# Altium project 000_stm32.PrjPcb
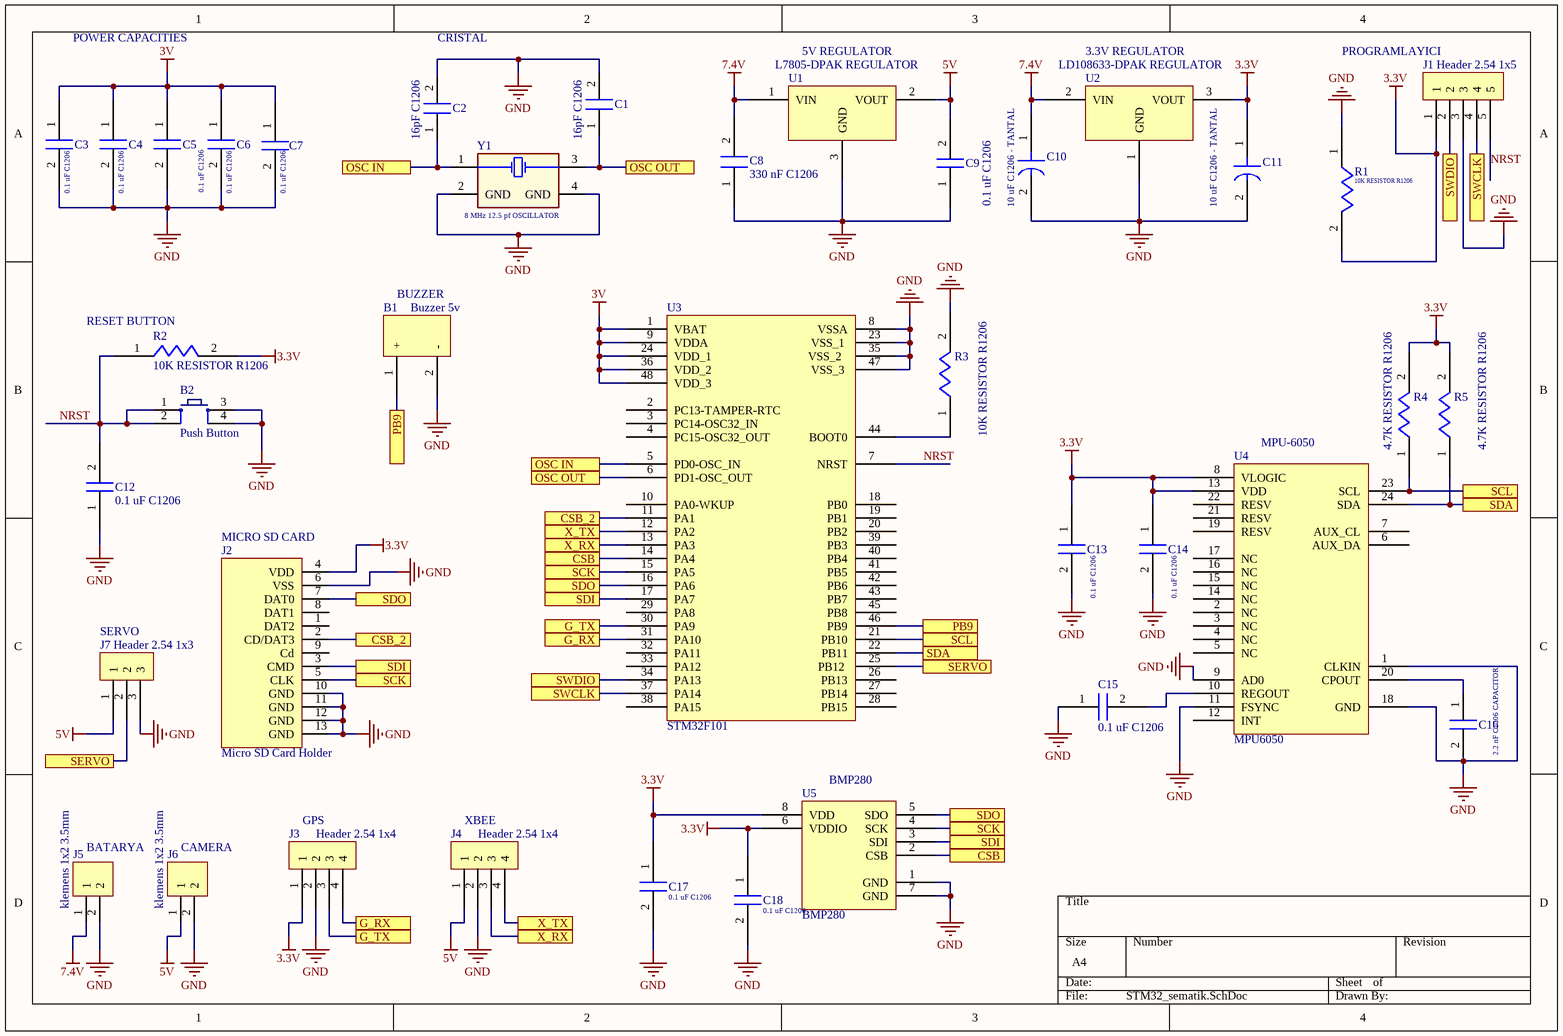
[diagram p0: STM32_sematik.SchDoc]
1 sheet, 38 parts. Net scope: flat (ports and power ports of the same name join across sheets).
Board file: STM32_PCB.PcbDoc

## Sheet STM32_sematik.SchDoc
size A4; SheetNumber: 1; SheetTotal: 1

### Parts
B1  Buzzer 5v  [Buzzer 5V]
B2  Push Button  [PUSB BUTTON-SMD]
C1  16pF C1206  [C1206]
C2  16pF C1206  [C1206]
C3  0.1 uF C1206  [C1206]
C4  0.1 uF C1206  [C1206]
C5  0.1 uF C1206  [C1206]
C6  0.1 uF C1206  [C1206]
C7  0.1 uF C1206  [C1206]
C8  330 nF C1206  [C1206]
C9  0.1 uF C1206  [C1206]
C10  10 uF C1206 - TANTAL  [C1206 - TANTAL]
C11  10 uF C1206 - TANTAL  [C1206 - TANTAL]
C12  0.1 uF C1206  [C1206]
C13  0.1 uF C1206  [C1206]
C14  0.1 uF C1206  [C1206]
C15  0.1 uF C1206  [C1206]
C16  2.2 nF C1206 CAPACITOR  [C1206]
C17  0.1 uF C1206  [C1206]
C18  0.1 uF C1206  [C1206]
J1  Header 2.54 1x5  [Header 2.54 1x5]
J2  Micro SD Card Holder  [Micro SD Card Holder]
J3  Header 2.54 1x4  [Header 2.54 1x4]
J4  Header 2.54 1x4  [Header 2.54 1x4]
J5  klemens 1x2 3.5mm  [klemens 1x2 3.5mm]
J6  klemens 1x2 3.5mm  [klemens 1x2 3.5mm]
J7  Header 2.54 1x3  [Header 2.54 1x3]
R1  10K RESISTOR R1206  [R1206 RESISTER]
R2  10K RESISTOR R1206  [R1206 RESISTER]
R3  10K RESISTOR R1206  [R1206 RESISTER]
R4  4.7K RESISTOR R1206  [R1206 RESISTER]
R5  4.7K RESISTOR R1206  [R1206 RESISTER]
U1  L7805-DPAK REGULATOR  [L7805 DPAK]
U2  LD108633-DPAK REGULATOR  [L7805 DPAK]
U3  STM32F101  [LQFP48-STM]
U4  MPU6050  [MPU6050]
U5  BMP280  [BMP280]
Y1  8 MHz 12.5 pf OSCILLATOR  [8 MHZ OSCILLATOR]

### Ports
CSB (see STM32_sematik[2C]), CSB (see STM32_sematik[3D]), CSB_2 (see STM32_sematik[1C]), CSB_2 (see STM32_sematik[2C]), G_RX (see STM32_sematik[1D]), G_RX (see STM32_sematik[2C]), G_TX (see STM32_sematik[1D]), G_TX (see STM32_sematik[2C]), OSC IN (see STM32_sematik[1A]), OSC IN (see STM32_sematik[2B]), OSC OUT (see STM32_sematik[2A]), OSC OUT (see STM32_sematik[2B]), PB9 (see STM32_sematik[2B]), PB9 (see STM32_sematik[3C]), SCK (see STM32_sematik[1C], STM32_sematik[2C]), SCK (see STM32_sematik[1C], STM32_sematik[3D]), SCK (see STM32_sematik[2C], STM32_sematik[3D]), SCL (see STM32_sematik[3C]), SCL (see STM32_sematik[4B]), SDA (see STM32_sematik[3C]), SDA (see STM32_sematik[4B]), SDI (see STM32_sematik[1C], STM32_sematik[2C]), SDI (see STM32_sematik[1C], STM32_sematik[3D]), SDI (see STM32_sematik[2C], STM32_sematik[3D]), SDO (see STM32_sematik[1C], STM32_sematik[2C]), SDO (see STM32_sematik[1C], STM32_sematik[3D]), SDO (see STM32_sematik[2C], STM32_sematik[3D]), SERVO (see STM32_sematik[1C]), SERVO (see STM32_sematik[3C]), SWCLK (see STM32_sematik[2C]), SWCLK (see STM32_sematik[4A]), SWDIO (see STM32_sematik[2C]), SWDIO (see STM32_sematik[4A]), X_RX (see STM32_sematik[2C]), X_RX (see STM32_sematik[2D]), X_TX (see STM32_sematik[2C]), X_TX (see STM32_sematik[2D])

### Nets
3.3V: C11.1 C13.1 C14.1 C17.1 C18.1 J1.1 J2.4(VDD) J3.1 R1.2 R2.2 R4.2 R5.2 U2.3(VOUT) U4.8(VLOGIC) U4.13(VDD) U5.6(VDDIO) U5.8(VDD)
3V: C3.1 C4.1 C5.1 C6.1 C7.1 U3.1(VBAT) U3.9(VDDA) U3.24(VDD_1) U3.36(VDD_2) U3.48(VDD_3)
5V: C9.2 J4.1 J6.1 J7.1 U1.2(VOUT)
7.4V: C8.2 C10.1 J5.1 U1.1(VIN) U2.2(VIN)
GND: B1.2(-) B2.3 B2.4 C1.2 C2.2 C3.2 C4.2 C5.2 C6.2 C7.2 C8.1 C9.1 C10.2 C11.2 C12.1 C13.2 C14.2 C15.1 C16.2 C17.2 C18.2 J1.3 J2.6(VSS) J2.10(GND) J2.11(GND) J2.12(GND) J2.13(GND) J3.2 J4.2 J5.2 J6.2 J7.3 R1.1 R3.2 U1.3(GND) U2.1(GND) U3.8(VSSA) U3.23(VSS_1) U3.35(VSS_2) U3.47(VSS_3) U4.1(CLKIN) U4.9(AD0) U4.11(FSYNC) U4.18(GND) U5.1(GND) U5.7(GND) Y1.2(GND) Y1.4(GND)
NRST: B2.1 B2.2 C12.2 J1.5 R2.1 U3.7(NRST)
NetB1_1: B1.1(+) U3.46(PB9) ; port PB9
NetC1_1: C1.1 U3.6(PD1-OSC_OUT) Y1.3 ; port OSC OUT
NetC2_1: C2.1 U3.5(PD0-OSC_IN) Y1.1 ; port OSC IN
NetC15_2: C15.2 U4.10(REGOUT)
NetC16_1: C16.1 U4.20(CPOUT)
NetJ1_2: J1.2 U3.34(PA13) ; port SWDIO
NetJ1_4: J1.4 U3.37(PA14) ; port SWCLK
NetJ2_2: J2.2(CD/DAT3) U3.11(PA1) ; port CSB_2
NetJ2_3: J2.3(CMD) U3.17(PA7) U5.3(SDI) ; port SDI
NetJ2_5: J2.5(CLK) U3.15(PA5) U5.4(SCK) ; port SCK
NetJ2_7: J2.7(DAT0) U3.16(PA6) U5.5(SDO) ; port SDO
NetJ3_3: J3.3 U3.30(PA9) ; port G_TX
NetJ3_4: J3.4 U3.31(PA10) ; port G_RX
NetJ4_3: J4.3 U3.13(PA3) ; port X_RX
NetJ4_4: J4.4 U3.12(PA2) ; port X_TX
NetJ7_2: J7.2 U3.25(PB12) ; port SERVO
NetR3_1: R3.1 U3.44(BOOT0)
NetR4_1: R4.1 U3.21(PB10) U4.23(SCL) ; port SCL
NetR5_1: R5.1 U3.22(PB11) U4.24(SDA) ; port SDA
NetU3_14: U3.14(PA4) U5.2(CSB) ; port CSB

Not connected (* = marked no-connect by the designer): J2 1(DAT2) 8(DAT1) 9(Cd); U3 2(PC13-TAMPER-RTC) 3(PC14-OSC32_IN) 4(PC15-OSC32_OUT) 10(PA0-WKUP) 18(PB0) 19(PB1) 20(PB2) 26(PB13) 27(PB14) 28(PB15) 29(PA8) 32(PA11) 33(PA12) 38(PA15) 39(PB3) 40(PB4) 41(PB5) 42(PB6) 43(PB7) 45(PB8); U4 2(NC) 3(NC) 4(NC) 5(NC) 6(AUX_DA) 7(AUX_CL) 12(INT) 14(NC) 15(NC) 16(NC) 17(NC) 19(RESV) 21(RESV) 22(RESV)

### Notes on the sheet
- POWER CAPACITIES
- CRISTAL
- (near U1) 5V REGULATOR
- (near U2) 3.3V REGULATOR
- (near J1) PROGRAMLAYICI
- BUZZER
- (near R2) RESET BUTTON
- (near U4) MPU-6050
- (near J2) MICRO SD CARD
- (near J7) SERVO
- (near U5) BMP280
- (near J5) BATARYA
- (near J6) CAMERA
- (near J3) GPS
- (near J4) XBEE

### Library data of the parts
B2 = Push Button: Smd Push Button; Satın Alma Linki: https://urun.n11.com/diger/mini-pushbutton-switch-smd-P227461537?gclid=Cj0KCQjwkoDmBRCcARIsAG3xzl8Y_-jeD7HocNM6lvuZ_rVp83568XPGtNzlPwXWLph8oCRqo0yh87UaApZYEALw_wcB&gclsrc=aw.ds
C1 C2 = 16pF C1206: 16 pF C1206
R1-R3 = 10K RESISTOR R1206: R1206 RESISTER
R4 R5 = 4.7K RESISTOR R1206: R1206 RESISTER
U1 = L7805-DPAK REGULATOR: L7805 5V REGULATOR SMD PAKET
U2 = LD108633-DPAK REGULATOR: LD108633 3.3V REGULATOR
U3 = STM32F101: STM32F101,48 pinli microislemci
U4 = MPU6050: MPU6050 GYRO
U5 = BMP280: BMP280 SENSOR